# EAGLE schematic diy_drivermotor (EAGLE 7.1.0)
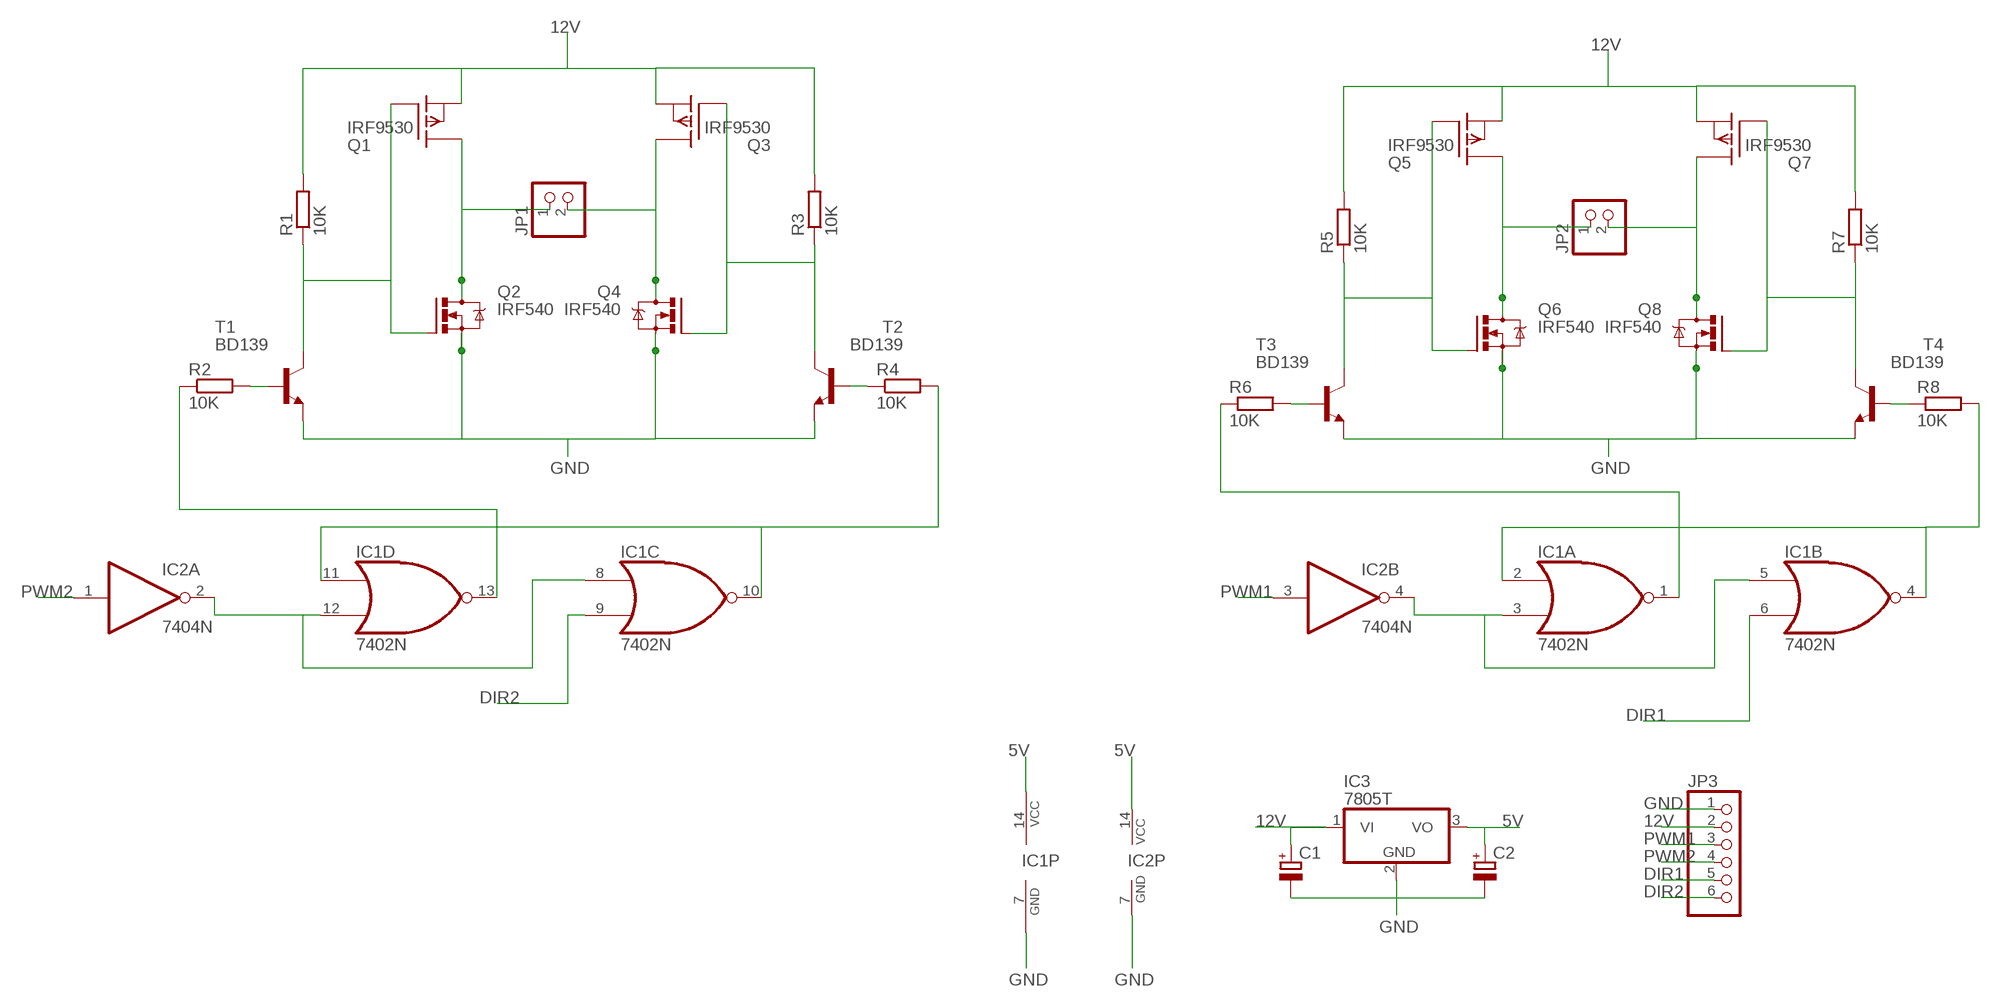
[diagram p0: schematic, sheet 1]

## Parts
C1  CPOL-EUE2.5-6  [E2,5-6]
C2  CPOL-EUE2.5-6  [E2,5-6]
IC1  7402N  [DIL14]
IC2  7404N  [DIL14]
IC3  7805T  [TO220H]
JP1  PINHD-1X2  [1X02]
JP2  PINHD-1X2  [1X02]
JP3  PINHD-1X6  [1X06]
Q1  IRF9530  [TO220]
Q2  IRF540  [TO220BV]
Q3  IRF9530  [TO220]
Q4  IRF540  [TO220BV]
Q5  IRF9530  [TO220]
Q6  IRF540  [TO220BV]
Q7  IRF9530  [TO220]
Q8  IRF540  [TO220BV]
R1  10K  R-EU_0207/7  [0207/7]
R2  10K  R-EU_0207/7  [0207/7]
R3  10K  R-EU_0207/7  [0207/7]
R4  10K  R-EU_0207/7  [0207/7]
R5  10K  R-EU_0207/7  [0207/7]
R6  10K  R-EU_0207/7  [0207/7]
R7  10K  R-EU_0207/7  [0207/7]
R8  10K  R-EU_0207/7  [0207/7]
T1  BD139  [TO126]
T2  BD139  [TO126]
T3  BD139  [TO126]
T4  BD139  [TO126]

## Nets
5V: C2.+ IC1.14(P:VCC) IC2.14(P:VCC) IC3.3(VO)
12V: C1.+ IC3.1(VI) JP3.2 Q1.3(S) Q3.3(S) Q5.3(S) Q7.3(S) R1.2 R3.2 R5.2 R7.2
DIR1: IC1.6(B:I1) JP3.5
DIR2: IC1.9(C:I1) JP3.6
GND: C1.- C2.- IC1.7(P:GND) IC2.7(P:GND) IC3.2(GND) JP3.1 Q2.S Q4.S Q6.S Q8.S T1.1(E) T2.1(E) T3.1(E) T4.1(E)
N$1: JP1.1 Q1.2(D) Q2.D
N$2: JP1.2 Q3.2(D) Q4.D
N$6: JP2.1 Q5.2(D) Q6.D
N$7: R2.2 T1.3(B)
N$8: R4.1 T2.3(B)
N$9: Q3.1(G) Q4.G R3.1 T2.2(C)
N$10: Q1.1(G) Q2.G R1.1 T1.2(C)
N$11: JP2.2 Q7.2(D) Q8.D
N$13: IC1.8(C:I0) IC1.12(D:I1) IC2.2(A:O)
N$16: IC1.10(C:O) IC1.11(D:I0) R4.2
N$17: R8.1 T4.3(B)
N$18: IC1.13(D:O) R2.1
N$19: R6.2 T3.3(B)
N$20: Q5.1(G) Q6.G R5.1 T3.2(C)
N$21: Q7.1(G) Q8.G R7.1 T4.2(C)
N$22: IC1.1(A:O) R6.1
N$24: IC1.3(A:I1) IC1.5(B:I0) IC2.4(B:O)
N$27: IC1.2(A:I0) IC1.4(B:O) R8.2
PWM1: IC2.3(B:I) JP3.3
PWM2: IC2.1(A:I) JP3.4
Unconnected: IC2.5(C:I) IC2.6(C:O) IC2.8(D:O) IC2.9(D:I) IC2.10(E:O) IC2.11(E:I) IC2.12(F:O) IC2.13(F:I)

## Library data of the parts
C1 C2 = rcl:CPOL-EU: POLARIZED CAPACITOR, European symbol
IC1 = 74xx-us:74*02: Quad 2-input NOR gate
IC2 = 74xx-eu:74*04: Hex INVERTER
IC3 = linear:78*: Positive VOLTAGE REGULATOR Source: http://cache.national.com/ds/LM/LM78L05.pdf http://www.fairchildsemi.com/ds/LM/LM7805.pdf
JP1 JP2 = pinhead:PINHD-1X2: PIN HEADER
JP3 = pinhead:PINHD-1X6: PIN HEADER
Q1 Q3 Q5 Q7 = transistor-fet:IRF9530: P-Channel Enhancement MOSFET (HEXFET); -100V; -12A; 0,3Ohm
Q2 Q4 Q6 Q8 = transistor-power:IRF540: HEXFET Power MOSFET
R1-R8 = rcl:R-EU_: RESISTOR, European symbol
T1-T4 = transistor:BD139: NPN TRANSISTOR